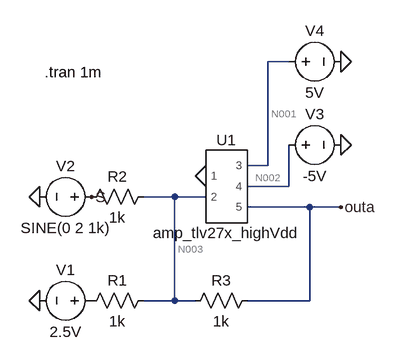
[diagram p0: schematic Pre-Lab-2-a.asc]
Pre-Lab-2-a.asc, the LTspice schematic file:
Version 4.1
SHEET 1 880 680
WIRE 64 64 32 64
WIRE 32 224 32 64
WIRE 32 224 0 224
WIRE 64 256 64 192
WIRE 64 256 0 256
WIRE -112 272 -160 272
WIRE -64 272 -112 272
WIRE 96 288 0 288
WIRE 144 288 96 288
WIRE -112 432 -112 272
WIRE -112 432 -160 432
WIRE -80 432 -112 432
WIRE 96 432 96 288
WIRE 96 432 0 432
FLAG -64 240 0
FLAG -320 432 0
FLAG -320 272 0
FLAG 144 64 0
FLAG 144 192 0
FLAG 144 288 outa
FLAG -240 272 S
SYMBOL amp_tlv27x_highVdd1 -32 256 R0
SYMATTR InstName U1
SYMBOL res -144 416 R90
WINDOW 0 0 56 VBottom 2
WINDOW 3 32 56 VTop 2
SYMATTR InstName R1
SYMATTR Value 1k
SYMBOL res -144 256 R90
WINDOW 0 0 56 VBottom 2
WINDOW 3 32 56 VTop 2
SYMATTR InstName R2
SYMATTR Value 1k
SYMBOL res 16 416 R90
WINDOW 0 0 56 VBottom 2
WINDOW 3 32 56 VTop 2
SYMATTR InstName R3
SYMATTR Value 1k
SYMBOL voltage -224 432 R90
WINDOW 0 -32 56 VBottom 2
WINDOW 3 32 56 VTop 2
WINDOW 123 0 0 Left 0
WINDOW 39 0 0 Left 0
SYMATTR InstName V1
SYMATTR Value 2.5V
SYMBOL voltage -224 272 R90
WINDOW 0 -32 56 VBottom 2
WINDOW 3 32 56 VTop 2
WINDOW 123 0 0 Left 0
WINDOW 39 0 0 Left 0
SYMATTR InstName V2
SYMATTR Value SINE(0 2 1k)
SYMBOL voltage 48 192 R270
WINDOW 0 32 56 VTop 2
WINDOW 3 -32 56 VBottom 2
WINDOW 123 0 0 Left 0
WINDOW 39 0 0 Left 0
SYMATTR InstName V3
SYMATTR Value -5V
SYMBOL voltage 48 64 R270
WINDOW 0 32 56 VTop 2
WINDOW 3 -32 56 VBottom 2
WINDOW 123 0 0 Left 0
WINDOW 39 0 0 Left 0
SYMATTR InstName V4
SYMATTR Value 5V
TEXT -312 80 Left 2 !.tran 1m

The netlist it stands for:
* Pre-Lab-2-a.asc
X§U1 0 N003 N001 N002 outa amp_tlv27x_highVdd  ; pins 1 2 3 4 5
R1 N003 P001 1k
R2 N003 S 1k
R3 outa N003 1k
V1 P001 0 2.5V
V2 S 0 SINE(0 2 1k)
V3 N002 0 -5V
V4 N001 0 5V
.tran 1m
.lib TLV271.LIB
.backanno
.end

* Results of the author's LTspice run, read from the files saved beside the schematic
* Operating Point, zero values left out:
*   V(n001) = 5 V
*   V(n002) = -5 V
*   V(n003) = -217.4 µV
*   V(outa) = -2.501 V
*   V(p001) = 2.5 V
*   I(R1) = -2.5 mA
*   I(R2) = -217.4 nA
*   I(R3) = -2.5 mA
*   I(V1) = -2.5 mA
*   I(V2) = -217.4 nA
*   I(V3) = 67.78 µA
*   I(V4) = -67.78 µA
*   Ix(u1:1) = -6.9 pA
*   Ix(u1:2) = -6.901 pA
*   Ix(u1:3) = 67.78 µA
*   Ix(u1:4) = -67.78 µA
*   Ix(u1:5) = 2.5 mA
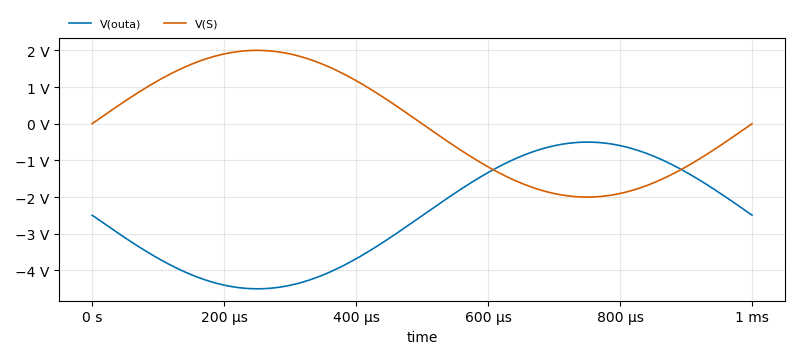
[diagram p1: Transient Analysis of Pre-Lab-2-a.asc, plotted from the saved traces]
* Transient Analysis, 1 run:
*   V(outa): min -4.5 V, max -500.8 mV, average -2.501 V, rms 2.873 V, last -2.492 V
*   V(S): min -2 V, max 2 V, average 0 V, rms 1.414 V, last 0 V